# EAGLE design nuksh (EAGLE 7.6.0)
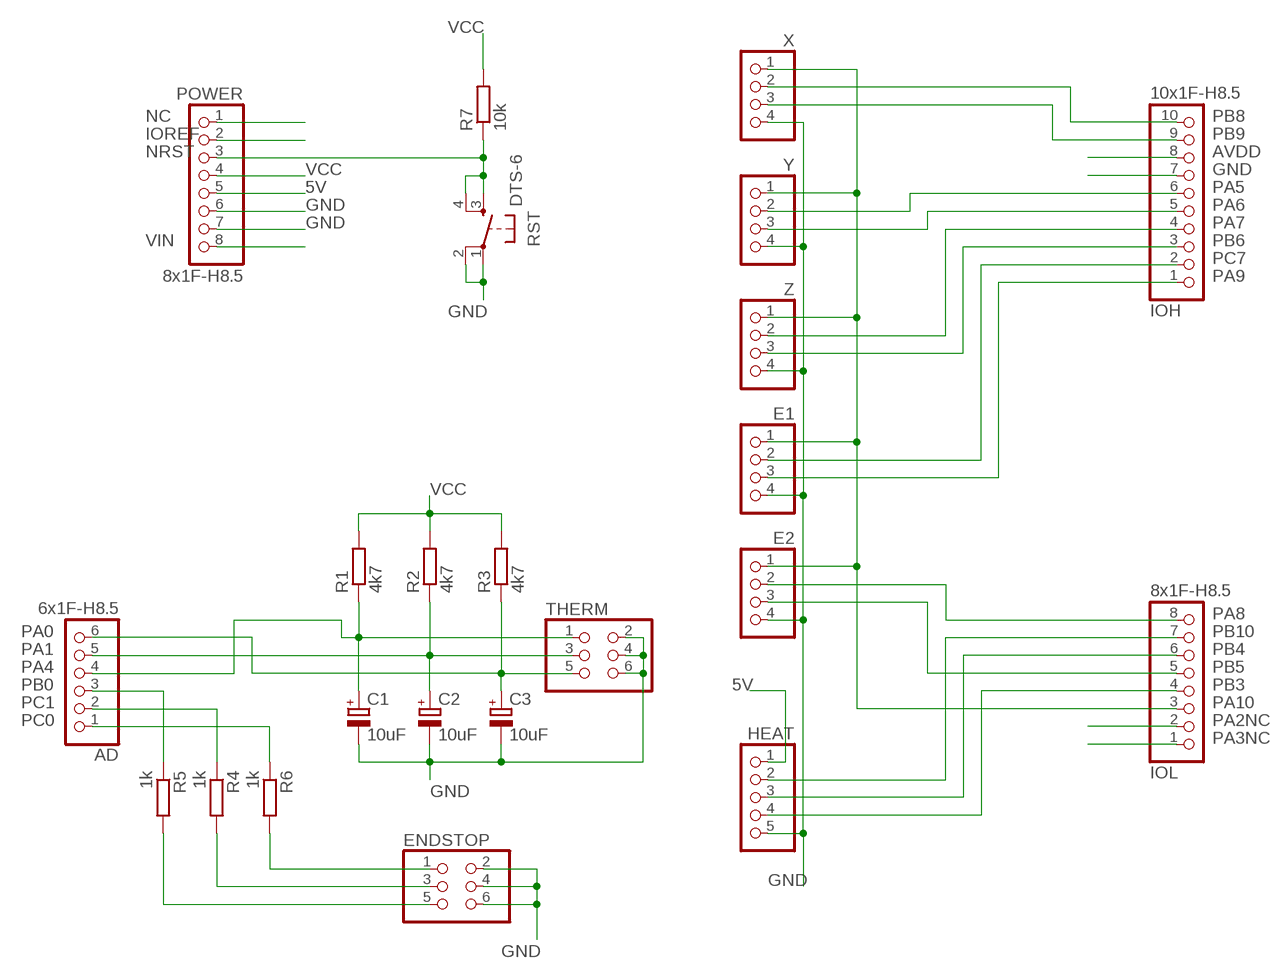
[diagram p0: schematic, sheet 1]

## Parts
AD  6x1F-H8.5  PINHD-1X6  [1X06]
C1  10uF  CPOL-EU153CLV-0605  [153CLV-0605]
C2  10uF  CPOL-EU153CLV-0605  [153CLV-0605]
C3  10uF  CPOL-EU153CLV-0605  [153CLV-0605]
E1  PINHD-1X4  [1X04]
E2  PINHD-1X4  [1X04]
ENDSTOP  PINHD-2X3  [2X03]
HEAT  PINHD-1X5  [1X05]
IOH  10x1F-H8.5  PINHD-1X10_ARD  [1X10]
IOL  8x1F-H8.5  PINHD-1X8  [1X08]
POWER  8x1F-H8.5  PINHD-1X8  [1X08]
R1  4k7  R-EU_R0805  [R0805]
R2  4k7  R-EU_R0805  [R0805]
R3  4k7  R-EU_R0805  [R0805]
R4  1k  R-EU_R0805  [R0805]
R5  1k  R-EU_R0805  [R0805]
R6  1k  R-EU_R0805  [R0805]
R7  10k  R-EU_R0805  [R0805]
RST  DTS-6  [DTS-6]
THERM  PINHD-2X3  [2X03]
X  PINHD-1X4  [1X04]
Y  PINHD-1X4  [1X04]
Z  PINHD-1X4  [1X04]

## Nets
5V: HEAT.1 POWER.5
AVDD: IOH.8
GND: C1.- C2.- C3.- E1.4 E2.4 ENDSTOP.2 ENDSTOP.4 ENDSTOP.6 HEAT.5 IOH.7 POWER.6 POWER.7 RST.1 RST.2 THERM.2 THERM.4 THERM.6 X.4 Y.4 Z.4
IOREF: POWER.2
N$2: ENDSTOP.5 R5.2
N$3: ENDSTOP.3 R4.2
N$4: ENDSTOP.1 R6.2
NC: POWER.1
NRST: POWER.3 R7.1 RST.3 RST.4
PA0: AD.4 C1.+ R1.1 THERM.1
PA1: AD.5 C2.+ R2.1 THERM.3
PA2NC: IOL.2
PA3NC: IOL.1
PA4: AD.6 C3.+ R3.1 THERM.5
PA5: IOH.6 Y.2
PA6: IOH.5 Y.3
PA7: IOH.4 Z.2
PA8: E2.2 IOL.8
PA9: E1.3 IOH.1
PA10: E1.1 E2.1 IOL.3 X.1 Y.1 Z.1
PB0: AD.3 R5.1
PB3: HEAT.4 IOL.4
PB4: HEAT.3 IOL.6
PB5: E2.3 IOL.5
PB6: IOH.3 Z.3
PB8: IOH.10 X.2
PB9: IOH.9 X.3
PB10: HEAT.2 IOL.7
PC0: AD.1 R6.1
PC1: AD.2 R4.1
PC7: E1.2 IOH.2
VCC: POWER.4 R1.2 R2.2 R3.2 R7.2
VIN: POWER.8

## Library data of the parts
AD = SmartPrj:PINHD-1X6: PIN HEADER
C1-C3 = rcl:CPOL-EU: POLARIZED CAPACITOR, European symbol
E1 E2 X Y Z = pinhead:PINHD-1X4: PIN HEADER
ENDSTOP THERM = pinhead:PINHD-2X3: PIN HEADER
HEAT = pinhead:PINHD-1X5: PIN HEADER
IOH = SmartPrj:PINHD-1X10_ARD: PIN HEADER
IOL POWER = SmartPrj:PINHD-1X8: PIN HEADER
R1-R7 = rcl:R-EU_: RESISTOR, European symbol
RST = switch-tact:DTS-6

## Net classes
0 default: width 0.254 mm, clearance 0.254 mm
1 power: width 0.61 mm, drill 0.61 mm, clearance 0.254 mm
2 gnd: width 0.305 mm, drill 0.559 mm, clearance 0.254 mm
3 usbvcc: width 0.508 mm, drill 0.61 mm, clearance 0.254 mm
4 aref: width 0.406 mm, drill 0.61 mm, clearance 0.254 mm

## Board
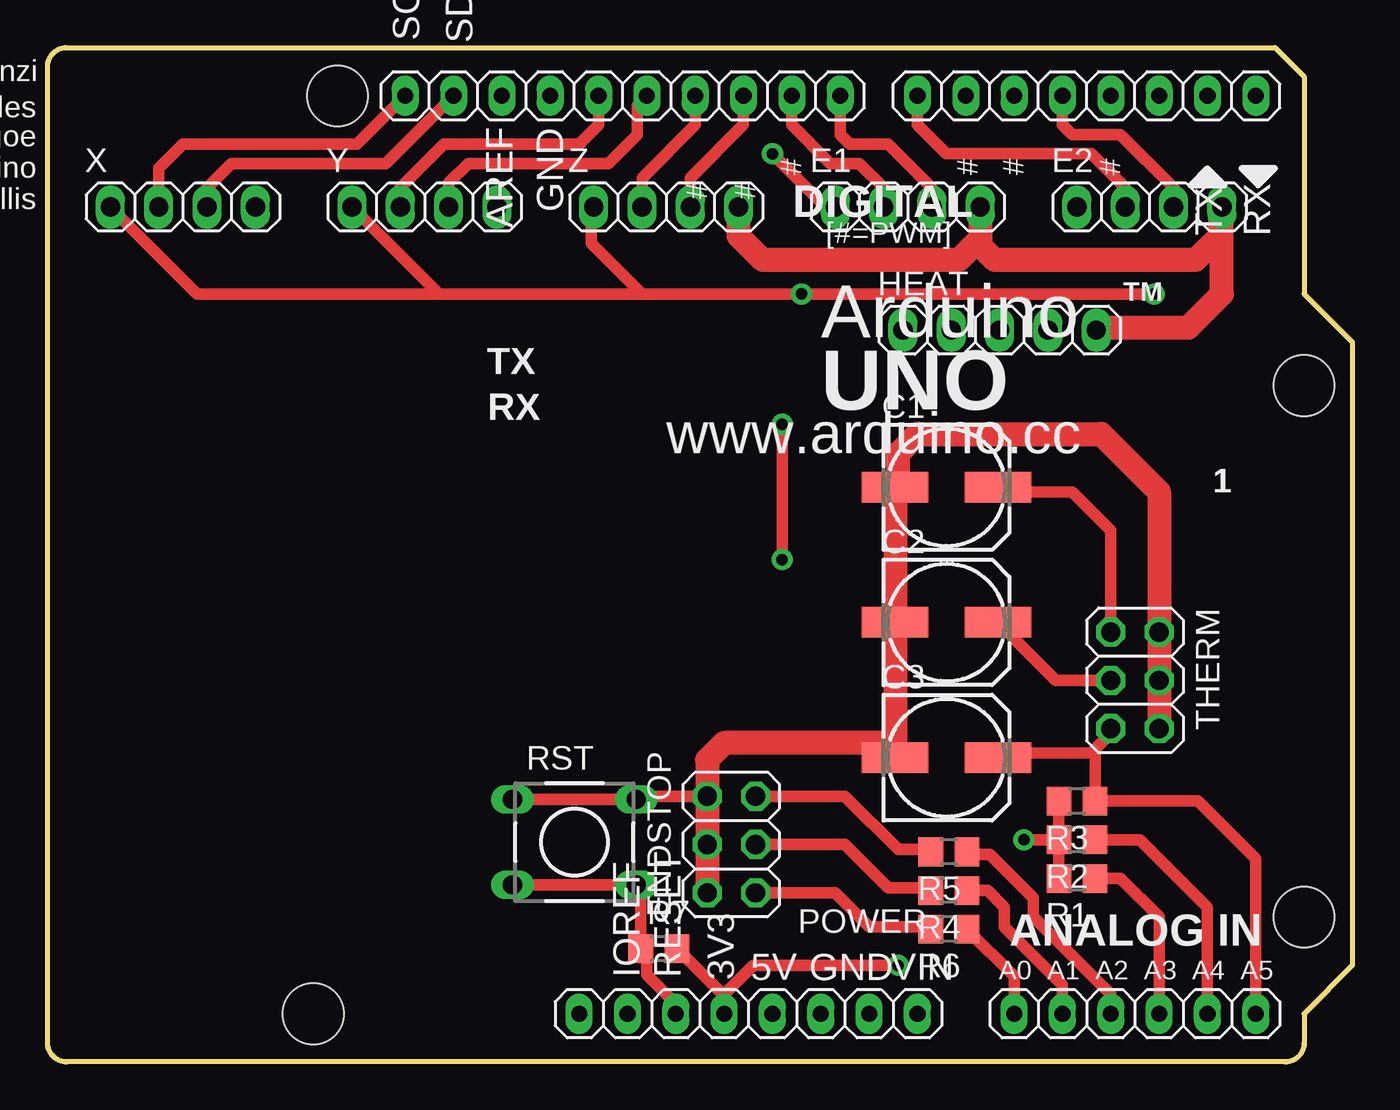
[diagram p1: board, top side]
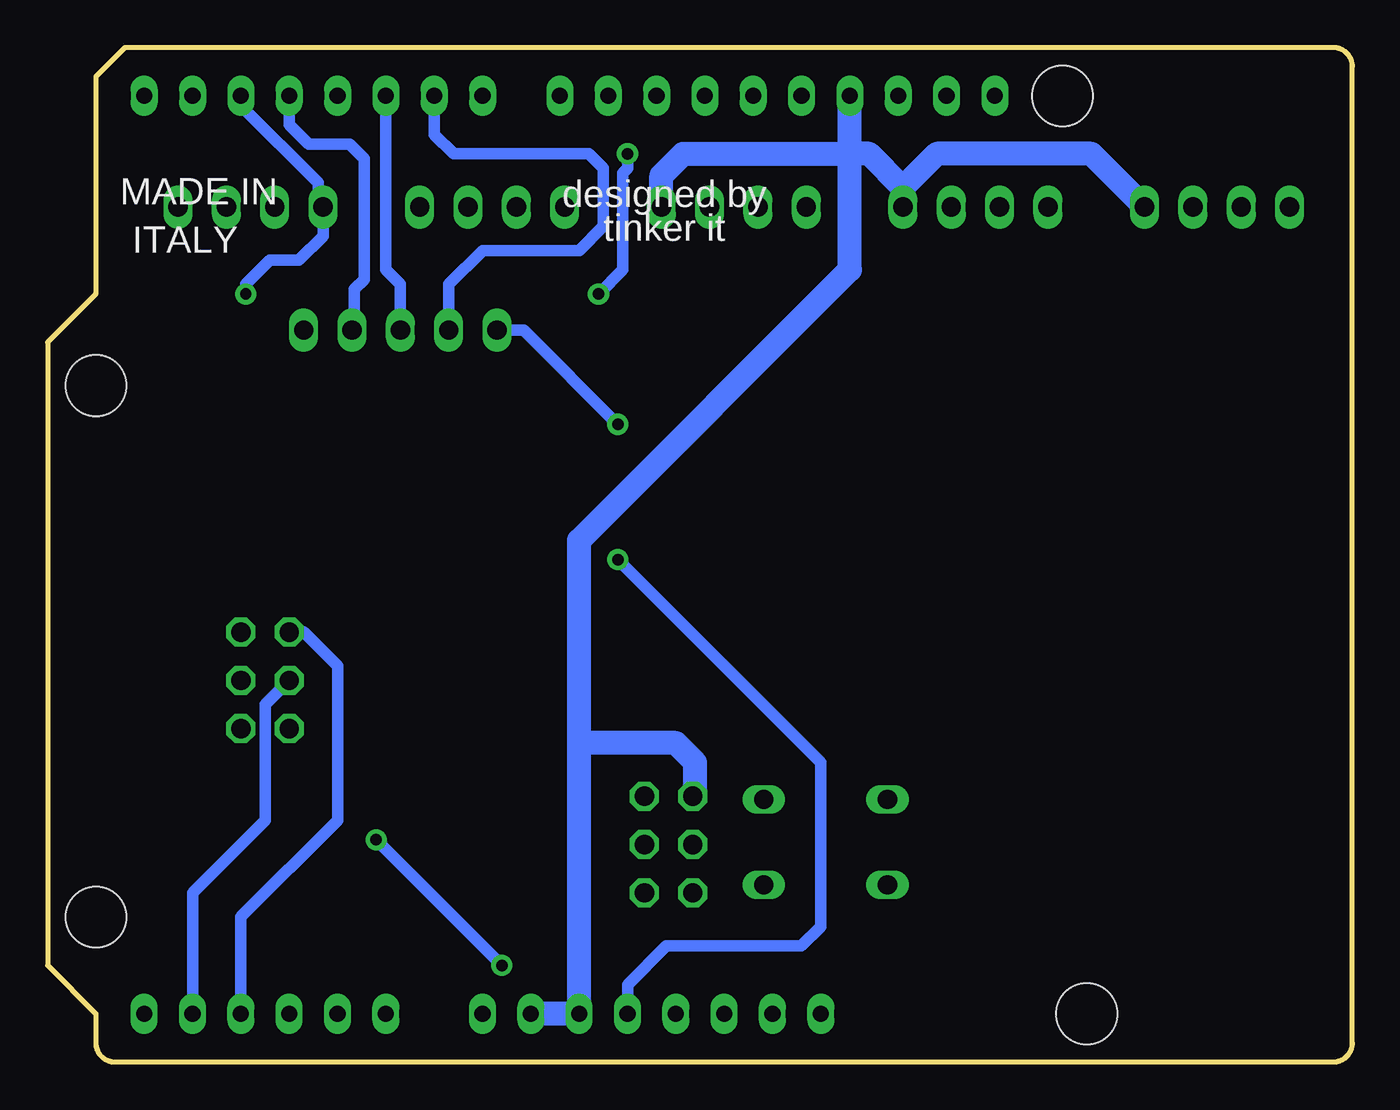
[diagram p2: board, bottom side, seen from below]

Size 68.58 x 53.34 mm. Coordinates in mm from the lower left corner, seen from the top.
Outline: 64.52,53.34 66.04,51.82 66.04,40.39 68.58,37.85 68.58,5.08 66.04,2.54 66.04,1 arc-90 65.04,0 1,0 arc-90 0,1 0,52.34 arc-90 1,53.34 64.52,53.34
Copper layers (1*16): Top 0.035mm / dielectric 1.5mm / Bottom 0.035mm
Design rules "default": minimum track width 10mil, minimum drill 22mil, track to track 10mil, track to pad 10mil, pad to pad 10mil, via to via 12mil, smd to smd 8mil, copper to edge 26mil, drill to drill 12mil, minimum pad ring 10mil, minimum via ring 10mil, stop-mask expansion 1mil, vias tented up to drill 30mil, thermal gap 10mil
Holes 3.2 mm at 66.04,35.56 66.04,7.62 15.24,50.8 13.97,2.54
vRestrict: area 22.9,44.1 to 24.6,49.1; area 25.4,45.5 to 27.1,49.1; area 28.4,45.3 to 29.6,48.8; area 31,45.3 to 32.1,48.8; area 33.5,45.3 to 34.7,48.8; area 36.1,45.3 to 37.2,48.8; area 38.7,47.2 to 39.9,48.8; area 40.3,45.1 to 47.6,46.9; area 60.3,44.2 to 61.7,46.7; area 62.9,44.2 to 64.3,46.7; area 61.3,35.8 to 64.8,37.2; area 0.6,21.8 to 2,30.1; 14 more areas

### Footprints (pad centres in the part's own frame; a part is rotated, then mirrored left to right if it is on the bottom)
1X06 = drill 0.85 pad 1.422 long: 1 -6.35,0; 2 -3.81,0; 3 -1.27,0; 4 1.27,0; 5 3.81,0; 6 6.35,0
153CLV-0605 = smd 3.5 x 1.6: + 2.7,0; - -2.7,0
1X04 = drill 1.016 long: 1 -3.81,0; 2 -1.27,0; 3 1.27,0; 4 3.81,0
2X03 = drill 1.016 octagon: 1 -2.54,-1.27; 2 -2.54,1.27; 3 0,-1.27; 4 0,1.27; 5 2.54,-1.27; 6 2.54,1.27
1X05 = drill 1.016 long: 1 -5.08,0; 2 -2.54,0; 3 0,0; 4 2.54,0; 5 5.08,0
1X10 = drill 0.85 pad 1.422 long: 1 -11.43,0; 2 -8.89,0; 3 -6.35,0; 4 -3.81,0; 5 -1.27,0; 6 1.27,0; 7 3.81,0; 8 6.35,0; 9 8.89,0; 10 11.43,0
1X08 = drill 0.85 pad 1.422 long: 1 -8.89,0; 2 -6.35,0; 3 -3.81,0; 4 -1.27,0; 5 1.27,0; 6 3.81,0; 7 6.35,0; 8 8.89,0
R0805 = smd 1.3 x 1.5: 1 -0.95,0; 2 0.95,0
DTS-6 = drill 1 long: 1 -3.25,2.25; 2 3.25,2.25; 3 -3.25,-2.25; 4 3.25,-2.25

### Placement (x,y rotation side)
AD  57.15,2.54 0 top
C1  47.24,30.23 0 top
C2  47.24,23.11 0 top
C3  47.24,16 0 top
E1  45.21,44.96 0 top
E2  57.91,44.96 0 top
ENDSTOP  35.94,11.43 90 top
HEAT  50.04,38.48 0 top
IOH  30.23,50.8 180 top
IOL  54.61,50.8 180 top
POWER  36.83,2.54 0 top
R1  54.1,9.65 180 top
R2  54.1,11.68 180 top
R3  54.1,13.72 180 top
R4  47.37,9.02 180 top
R5  47.37,11.05 180 top
R6  47.37,6.99 180 top
R7  32.13,5.97 0 top
RST  27.69,11.56 0 top
THERM  57.15,20.07 270 top
X  7.11,44.96 0 top
Y  19.81,44.96 0 top
Z  32.51,44.96 0 top

### Tracks (layer width: path | path; a pad name or v marks a point on that pad's centre or on a via)
5V  (via drill 0.6)
  Top 0.61: v38.61,26.42 v38.61,33.53
  Bottom 0.61: POWER.5 38.1,4.06 36.07,6.1 28.96,6.1 27.94,7.11 27.94,15.75 v38.61,26.42 | v38.61,33.53 43.56,38.48 HEAT.1
GND
  Top 0.61: C1.- 44.7,30.39 | RST.1 RST.2 31.1,13.97 ENDSTOP.6
  Top 1.27: C1.- C2.- C3.- 43.78,16.76 35.56,16.76 34.67,15.88 ENDSTOP.6 ENDSTOP.4 ENDSTOP.2 | 44.7,30.39 44.7,32 45.72,33.02 55.37,33.02 58.42,29.97 THERM.2 THERM.4 THERM.6 | E1.4 49.02,43.31 | 49.02,43.31 47.88,42.16 37.59,42.16 36.32,43.43 Z.4 | 49.02,43.31 49.02,42.93 49.78,42.16 60.33,42.16 61.59,43.43 61.59,44.83 E2.4 61.72,40.39 59.94,38.61 55.24,38.61 HEAT.5
  Bottom 1.27: POWER.7 POWER.6 40.64,16.76 | 40.64,16.76 40.64,27.43 26.42,41.66 26.42,47.75 | 26.42,47.75 IOH.7 | ENDSTOP.6 34.54,14.1 34.54,15.75 35.56,16.76 40.64,16.76 | X.4 13.72,47.75 21.84,47.75 23.62,45.97 | 23.62,45.97 Y.4 | 23.62,45.97 25.4,47.75 26.42,47.75 | Z.4 36.32,46.61 35.18,47.75 26.42,47.75
N$2
  Top 0.61: R5.2 46.29,11.18 44.7,11.18 41.91,13.97 ENDSTOP.5
N$3
  Top 0.61: R4.2 46.29,9.14 44.2,9.14 41.91,11.43 ENDSTOP.3
N$4
  Top 0.61: R6.2 46.29,7.11 43.18,7.11 41.4,8.89 ENDSTOP.1
NRST
  Top 0.61: RST.3 RST.4 31.18,9.06 R7.1 31.5,5.65 31.5,4.57 33.02,3.05 POWER.3
PA0
  Top 0.61: C1.+ 50.2,29.97 53.85,29.97 55.88,27.94 THERM.1 | AD.4 58.42,7.62 56.39,9.65 R1.1
  Bottom 0.61: AD.4 58.42,7.62 53.34,12.7 53.34,20.83 55.12,22.61 THERM.1
PA1
  Top 0.61: C2.+ 52.99,20.07 THERM.3 | AD.5 60.96,8.13 57.4,11.68 R2.1
  Bottom 0.61: THERM.3 57.15,18.8 57.15,12.7 60.96,8.89 AD.5
PA4
  Top 0.61: C3.+ 50.2,16.26 54.86,16.26 | 54.86,16.26 55.88,17.27 THERM.5 | 54.86,16.26 55.05,16.07 R3.1 60.45,13.72 63.5,10.67 AD.6
PA5
  Top 0.61: IOH.6 28.96,49.28 27.94,48.26 20.83,48.26 18.54,45.97 Y.2
PA6
  Top 0.61: IOH.5 30.99,50.29 30.99,48.77 29.46,47.24 22.1,47.24 21.08,46.23 Y.3
PA7
  Top 0.61: IOH.4 34.04,49.28 31.24,46.48 Z.2
PA8
  Top 0.61: IOL.8 45.72,49.28 47.24,47.75 54.86,47.75 56.64,45.97 E2.2
PA9
  Top 0.61: IOH.1 41.66,48.77 42.16,48.26 44.2,48.26 46.48,45.97 E1.3
PA10  (via drill 0.6)
  Top 0.61: v58.17,40.39 v39.62,40.39 31.24,40.39 | v38.1,47.75 40.89,44.96 E1.1 | Z.1 28.57,44.83 28.57,43.05 31.24,40.39 | Y.1 20.57,40.39 | 20.57,40.39 20.83,40.39 31.24,40.39 | X.1 7.87,40.39 20.57,40.39
  Bottom 0.61: IOL.3 58.42,50.29 54.36,46.23 54.36,45.21 E2.1 54.1,43.43 55.37,42.16 56.9,42.16 58.17,40.89 v58.17,40.39 | v39.62,40.39 38.35,41.66 38.35,46.74 38.1,46.99 v38.1,47.75
PB0
  Top 0.61: R5.1 48.45,10.92 49.53,10.92 51.82,8.64 51.82,7.62 55.88,3.56 AD.3
PB3
  Bottom 0.61: HEAT.4 52.45,38.61 52.45,40.64 51.94,41.15 51.94,47.5 52.7,48.26 54.86,48.26 55.88,49.28 IOL.4
PB4
  Bottom 0.61: HEAT.3 50.04,40.89 50.8,41.66 IOL.6
PB5
  Top 0.61: IOL.5 53.34,49.28 53.85,48.77 56.39,48.77 59.18,45.97 E2.3
PB6
  Top 0.61: IOH.3 36.58,49.28 33.78,46.48 Z.3
PB8
  Top 0.61: IOH.10 16.26,48.26 7.11,48.26 5.84,46.99 X.2
PB9
  Top 0.61: IOH.9 17.78,47.24 9.65,47.24 8.38,45.97 X.3
PB10
  Bottom 0.61: IOL.7 48.26,48.77 47.24,47.75 40.13,47.75 39.37,46.99 39.37,43.94 40.64,42.67 45.72,42.67 47.5,40.89 HEAT.2
PC0
  Top 0.61: R6.1 50.8,4.51 AD.1
PC1
  Top 0.61: R4.1 49.4,9.02 50.29,8.13 50.29,7.11 53.34,4.06 AD.2
PC7
  Top 0.61: IOH.2 39.12,49.28 41.15,47.24 42.67,47.24 43.94,45.97 E1.2
VCC  (via drill 0.6)
  Top 0.61: R1.2 R2.2 | R2.2 53.34,11.68 53.15,11.87 R3.2 | R2.2 v51.31,11.68 | v44.7,5.08 37.08,5.08 35.56,3.56 35.56,3.49 | POWER.4 35.56,3.05 35.56,3.49 | R7.2 35.56,3.49
  Bottom 0.61: v51.31,11.68 v44.7,5.08

### Text on the board
tNames: SCL | SDA | M.Banzi | D.Cuartielles | T.Igoe | AREF | GND | G.Martino | # | # | # | # | D.Mellis | # | # | DIGITAL | [#=PWM] | TX | RX | TM | TX | Arduino | RX | UNO | www.arduino.cc | 1 | ANALOG IN | IOREF | RESET | 3V3 | 5V | GND | VIN | A0 | A1 | A2 | A3 | A4 | A5
bNames: MADE IN | designed by | MADE IN | ITALY | tinker it | ITALY | designed by | tinker it | ATMEGA328
ReferenceLC: L | TX | ON | RX | PC1 | PC2
214bmp: D:/SmartProjects/Snc/a4_bn_logo2.bmp